# Altium project Chap7-1.PrjPCB
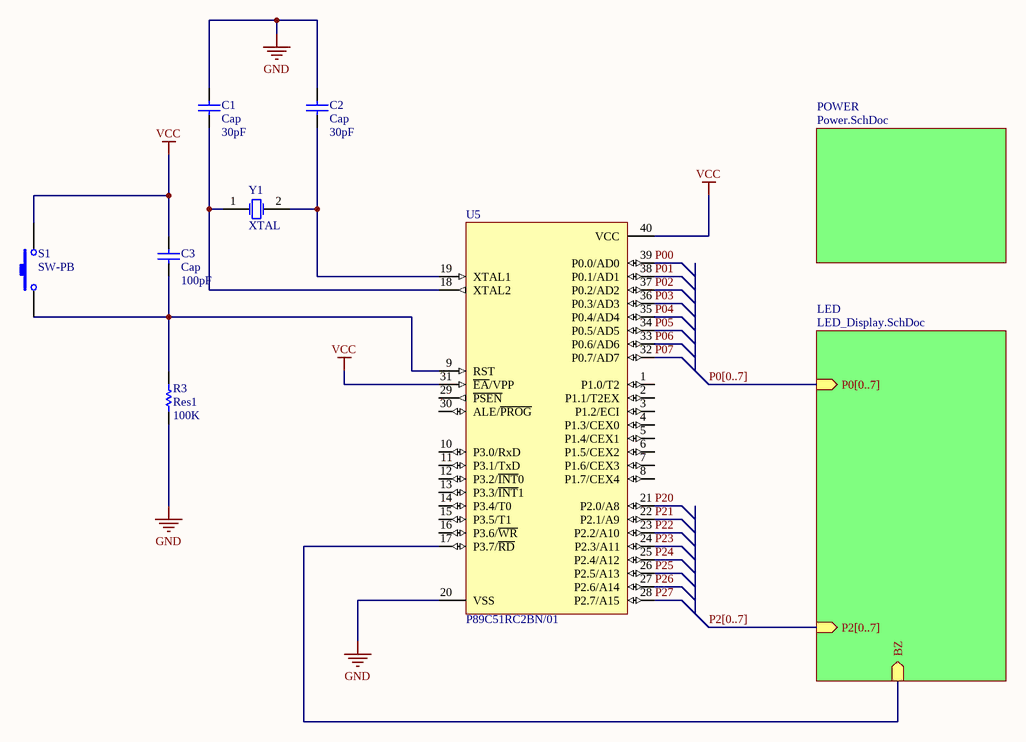
[diagram p0: MCU.SchDoc]
3 sheets, 31 parts. Net scope: hierarchical (ports join the sheet entries above them; power ports are global).
Sheets:
  MCU.SchDoc
    POWER = Power.SchDoc
    LED = LED_Display.SchDoc

## Sheet MCU.SchDoc
size A4

### Parts
C1  Cap  value 30pF  [RAD-0.3]
C2  Cap  value 30pF  [RAD-0.3]
C3  Cap  value 100pF  [RAD-0.3]
R3  Res1  value 100K  [AXIAL-0.3]
S1  SW-PB  [SPST-2]
U5  P89C51RC2BN/01  [SOT129-1]
Y1  XTAL  [R38]

### Sub-sheets
LED = LED_Display.SchDoc: P0[0..7] (in), P2[0..7] (in), BZ (in)
POWER = Power.SchDoc: no entries

### Nets
GND: C1.2 C2.2 R3.1 U5.20(VSS)
VCC: C3.2 S1.2 U5.31(~{EA}/VPP) U5.40(VCC)
P00: U5.39(P0.0/AD0)
P01: U5.38(P0.1/AD1)
P02: U5.37(P0.2/AD2)
P03: U5.36(P0.3/AD3)
P04: U5.35(P0.4/AD4)
P05: U5.34(P0.5/AD5)
P06: U5.33(P0.6/AD6)
P07: U5.32(P0.7/AD7)
P20: U5.21(P2.0/A8)
P21: U5.22(P2.1/A9)
P22: U5.23(P2.2/A10)
P23: U5.24(P2.3/A11)
P24: U5.25(P2.4/A12)
P25: U5.26(P2.5/A13)
P26: U5.27(P2.6/A14)
P27: U5.28(P2.7/A15)
NetC1_1: C1.1 U5.18(XTAL2) Y1.1(OSC1)
NetC2_1: C2.1 U5.19(XTAL1) Y1.2(OSC2)
NetC3_1: C3.1 R3.2 S1.1 U5.9(RST)
NetR1_1: U5.17(P3.7/~{RD}) ; sheet LED/BZ

Not connected (* = marked no-connect by the designer): U5 1(P1.0/T2) 2(P1.1/T2EX) 3(P1.2/ECI) 4(P1.3/CEX0) 5(P1.4/CEX1) 6(P1.5/CEX2) 7(P1.6/CEX3) 8(P1.7/CEX4) 10(P3.0/RxD) 11(P3.1/TxD) 12(P3.2/~{INT}0) 13(P3.3/~{INT}1) 14(P3.4/T0) 15(P3.5/T1) 16(P3.6/~{WR}) 29(~{PSEN}) 30(ALE/~{PROG})

### Buses and harness runs
bus P0[0..7] = sheet LED/P0[0..7]
bus P2[0..7] = sheet LED/P2[0..7]

### Library data of the parts
C1-C3 = Cap: Capacitor; Published: 8-Jun-2000; LatestRevisionDate: 17-Jul-2002; LatestRevisionNote: Re-released for DXP Platform.; PackageReference: RAD-0.3; Publisher: Altium Limited; PackageDescription: Radial Cap, Thru-Hole; 2 Leads; 0.3 in Pin Spacing
R3 = Res1: Resistor; Published: 8-Jun-2000; LatestRevisionDate: 17-Jul-2002; LatestRevisionNote: Re-released for DXP Platform.; PackageReference: AXIAL-0.3; Publisher: Altium Limited; PackageDescription: Axial Device, Thru-Hole; 2 Leads; 0.3 in Pin Spacing
S1 = SW-PB: Switch; Published: 24-Mar-1999; LatestRevisionDate: 17-Jul-2002; LatestRevisionNote: Re-released for DXP Platform.; PackageReference: SPST-2; Publisher: Altium Limited; PackageDescription: Switch; 2 Leads
U5 = P89C51RC2BN/01: 80C51 8-Bit Flash Microcontroller Family, 32 kB ISP/IAP Flash with 512 B RAM.; Published: 21-May-2003; DatasheetVersion: 18-Jul-2002; PackageVersion: Aug-2000; PackageReference: SOT129-1; Publisher: Altium Limited; PackageDescription: DIP, Plastic; 40 Leads; Row Spacing 15.24 mm; Pitch 2.54 mm; Code_JEDEC: MO-015; ComponentLink1Description: Manufacturer Link; ComponentLink1URL: http://www-us2.semiconductors.philips.com/; ComponentLink2Description: Datasheet; ComponentLink2URL: http://www.semiconductors.philips.com/acrobat/datasheets/P89C51RA2_RB2_RC2_RD2_2.pdf
Y1 = XTAL: Crystal Oscillator; Published: 8-Jun-2000; LatestRevisionDate: 17-Jul-2002; LatestRevisionNote: Re-released for DXP Platform.; PackageReference: R38; Publisher: Altium Limited; PackageDescription: Crystal, Thru-Hole; 2 Leads; Body 3.1 x 8.2 mm (Dia.xH)

## Sheet Power.SchDoc
size A4
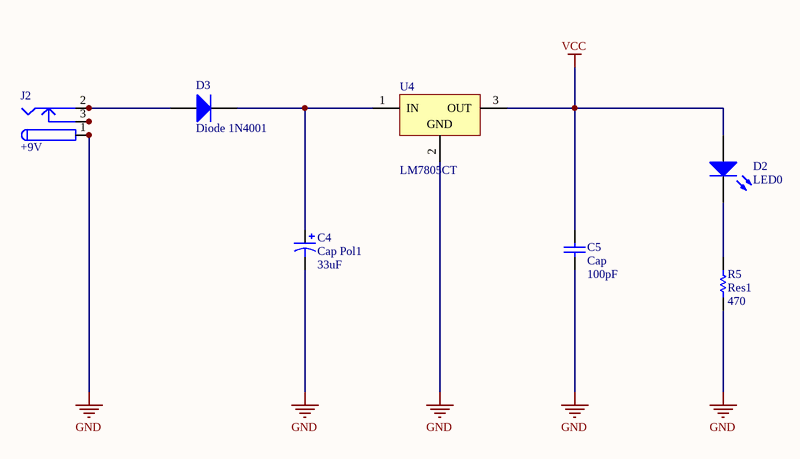
[diagram p1: Power.SchDoc]

### Parts
C4  Cap Pol1  value 33uF  [RB7.6-15]
C5  Cap  value 100pF  [RAD-0.3]
D2  LED0  [LED-0]
D3  Diode 1N4001  [DO-41]
J2  +9V  [KLD-0202]
R5  Res1  value 470  [AXIAL-0.3]
U4  LM7805CT  [T03B]

### Nets
GND: C4.2 C5.1 J2.1 J2.1A J2.1B R5.1 U4.2(GND)
VCC: C5.2 D2.1(A) U4.3(OUT)
NetC4_1: C4.1 D3.2(K) U4.1(IN)
NetD2_2: D2.2(K) R5.2
NetD3_1: D3.1(A) J2.2 J2.2A J2.2B
NetJ2_3: J2.3 J2.3A J2.3B

### Library data of the parts
C4 = Cap Pol1: Polarized Capacitor (Radial); Published: 8-Jun-2000; LatestRevisionDate: 17-Jul-2002; LatestRevisionNote: Re-released for DXP Platform.; PackageReference: RB7.6-15; Publisher: Altium Limited; PackageDescription: Polarized Capacitor (Radial); 2 Leads
C5 = Cap: Capacitor; Published: 8-Jun-2000; LatestRevisionDate: 17-Jul-2002; LatestRevisionNote: Re-released for DXP Platform.; PackageReference: RAD-0.3; Publisher: Altium Limited; PackageDescription: Radial Cap, Thru-Hole; 2 Leads; 0.3 in Pin Spacing
D2 = LED0: Typical INFRARED GaAs LED; Published: 8-Jun-2000; LatestRevisionDate: 08-Jul-2005; LatestRevisionNote: Mech Layer 1 removed.; PackageReference: LED-0; Publisher: Altium Limited; PackageDescription: LED; 2 Leads
D3 = Diode 1N4001: 1 Amp General Purpose Rectifier; Published: 8-Jun-2000; LatestRevisionDate: 17-Jul-2002; LatestRevisionNote: Re-released for DXP Platform.; DatasheetVersion: 1998; PackageVersion: Aug-1999; PackageReference: DO-41; Publisher: Altium Limited; PackageDescription: Diode, Axial; Body 5.2 x 2.7 mm (LxDia. max), Lead Dia. 0.86 mm (max); Code_JEDEC: DO-204-AL; ComponentLink1Description: Manufacturer Link; ComponentLink1URL: http://www.fairchildsemi.com/; ComponentLink2Description: Datasheet; ComponentLink2URL: http://www.fairchildsemi.com/ds/1N%2F1N4001.pdf
J2 = PWR2.5: Low Voltage Power Supply Connector; Published: 17-Dec-2003; DatasheetDocument: 09-May-2002; Publisher: Altium Limited; ComponentLink1Description: Manufacturer Link; ComponentLink1URL: http://domino.kycon.com/internet/Products.html
R5 = Res1: Resistor; Published: 8-Jun-2000; LatestRevisionDate: 17-Jul-2002; LatestRevisionNote: Re-released for DXP Platform.; PackageReference: AXIAL-0.3; Publisher: Altium Limited; PackageDescription: Axial Device, Thru-Hole; 2 Leads; 0.3 in Pin Spacing
U4 = LM7818CT: Series 3-Terminal Positive Regulator; Note: Tab is connected to GND; ComponentAvailability: Obsolete; Published: 15-Apr-2002; DatasheetVersion: May-1999; PackageVersion: 1995; PackageReference: T03B; Publisher: Altium Limited; PackageDescription: TO, Thru-Hole, Vertical, Heatsink Mounted; 3 In-Line Leads; Pitch 2.54 mm; ComponentLink1Description: Manufacturer Link; ComponentLink1URL: http://www.national.com/; ComponentLink2Description: Discontinuation Notice; ComponentLink2URL: http://www.national.com/obs/obsolescence.txt

## Sheet LED_Display.SchDoc
size A4
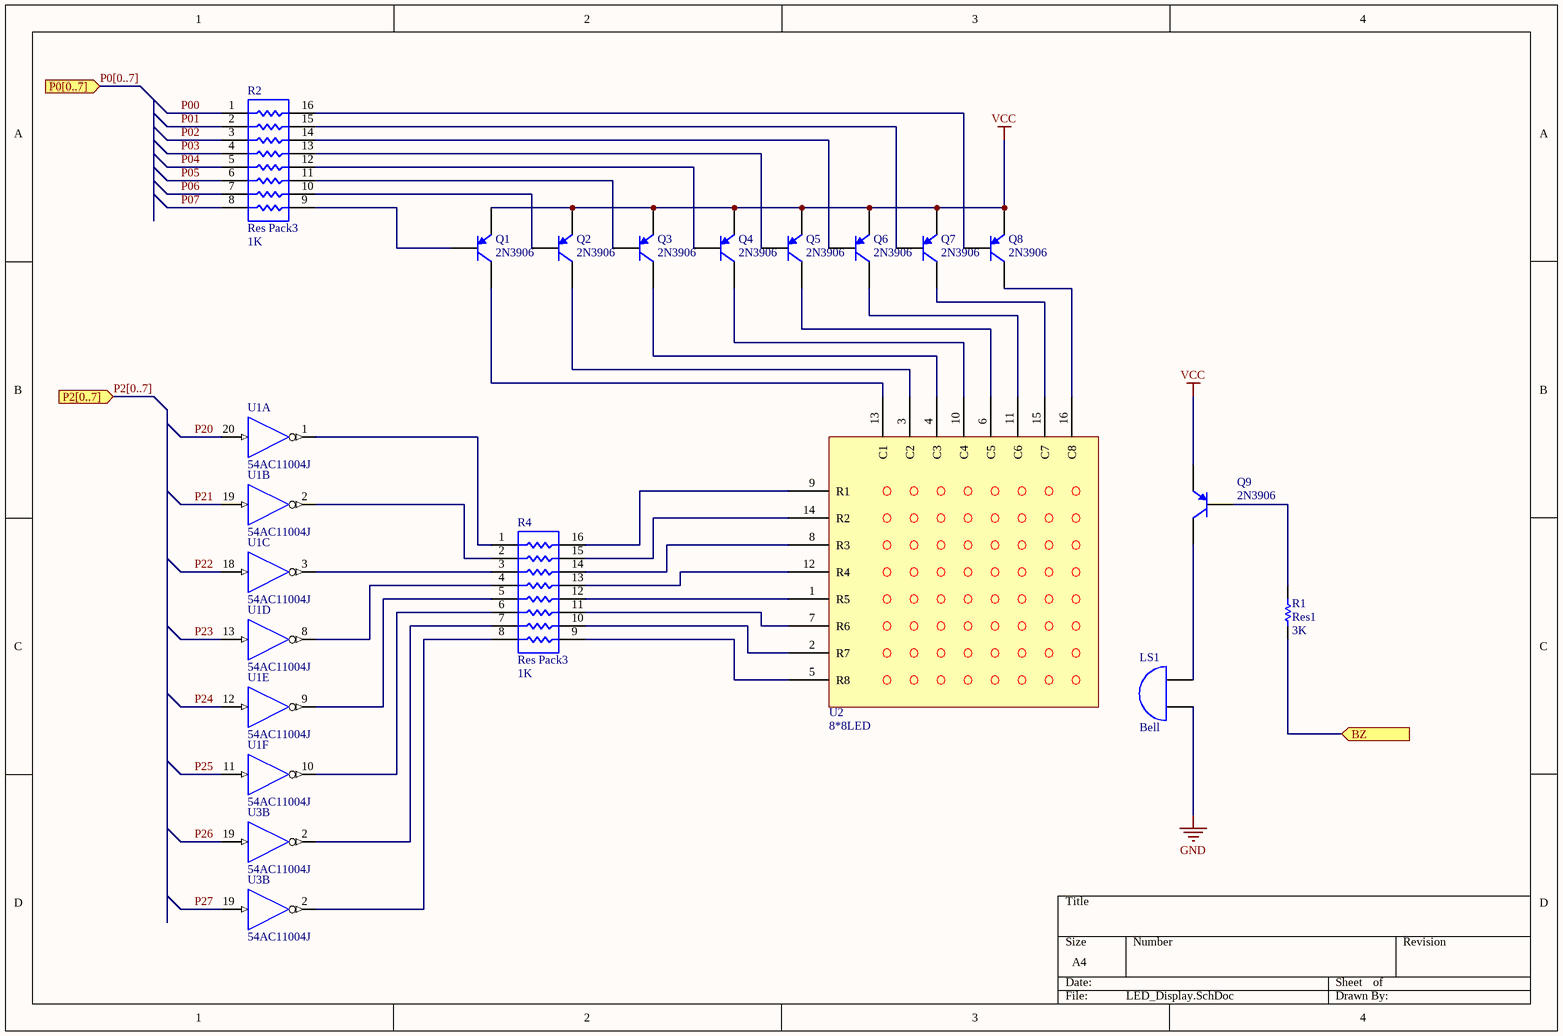
[diagram p2: LED_Display.SchDoc]

### Parts
(Parts that share a designator on the sheet are numbered #1, #2 ... from top to bottom, then left to right.)
LS1  Bell  [PIN2]
Q1  2N3906  [TO-92A]
Q2  2N3906  [TO-92A]
Q3  2N3906  [TO-92A]
Q4  2N3906  [TO-92A]
Q5  2N3906  [TO-92A]
Q6  2N3906  [TO-92A]
Q7  2N3906  [TO-92A]
Q8  2N3906  [TO-92A]
Q9  2N3906  [TO-92A]
R1  Res1  value 3K  [AXIAL-0.3]
R2  Res Pack3  value 1K  [SO-16_N]
R4  Res Pack3  value 1K  [SO-16_N]
U1  54AC11004J  [J020D]  (parts A,B,C,D,E,F of 6)
U2  8*8LED  [8*8LED]
U3#1  54AC11004J  [J020D]  (part B of 6)
U3#2  54AC11004J  [J020D]  (part B of 6)

### Ports
BZ (in), P0[0..7] (in), P2[0..7] (in)

### Nets
GND: LS1.1(A) U1.4(GND) U1.5(GND) U1.6(GND) U1.7(GND) U3#1.4(GND) U3#1.5(GND) U3#1.6(GND) U3#1.7(GND) U3#2.4(GND) U3#2.5(GND) U3#2.6(GND) U3#2.7(GND)
VCC: Q1.1(E) Q2.1(E) Q3.1(E) Q4.1(E) Q5.1(E) Q6.1(E) Q7.1(E) Q8.1(E) Q9.1(E) U1.15(VCC) U1.16(VCC) U3#1.15(VCC) U3#1.16(VCC) U3#2.15(VCC) U3#2.16(VCC)
P00: R2.1
P01: R2.2
P02: R2.3
P03: R2.4
P04: R2.5
P05: R2.6
P06: R2.7
P07: R2.8
P20: U1.20(A)
P21: U1.19(A)
P22: U1.18(A)
P23: U1.13(A)
P24: U1.12(A)
P25: U1.11(A)
P26: U3#1.19(A)
P27: U3#2.19(A)
NetLS1_2: LS1.2(B) Q9.3(C)
NetQ1_2: Q1.2(B) R2.9
NetQ1_3: Q1.3(C) U2.13(C1)
NetQ2_2: Q2.2(B) R2.10
NetQ2_3: Q2.3(C) U2.3(C2)
NetQ3_2: Q3.2(B) R2.11
NetQ3_3: Q3.3(C) U2.4(C3)
NetQ4_2: Q4.2(B) R2.12
NetQ4_3: Q4.3(C) U2.10(C4)
NetQ5_2: Q5.2(B) R2.13
NetQ5_3: Q5.3(C) U2.6(C5)
NetQ6_2: Q6.2(B) R2.14
NetQ6_3: Q6.3(C) U2.11(C6)
NetQ7_2: Q7.2(B) R2.15
NetQ7_3: Q7.3(C) U2.15(C7)
NetQ8_2: Q8.2(B) R2.16
NetQ8_3: Q8.3(C) U2.16(C8)
NetQ9_2: Q9.2(B) R1.2
NetR1_1: R1.1 ; port BZ
NetR4_1: R4.1 U1.1(Y)
NetR4_2: R4.2 U1.2(Y)
NetR4_3: R4.3 U1.3(Y)
NetR4_4: R4.4 U1.8(Y)
NetR4_5: R4.5 U1.9(Y)
NetR4_6: R4.6 U1.10(Y)
NetR4_7: R4.7 U3#1.2(Y)
NetR4_8: R4.8 U3#2.2(Y)
NetR4_9: R4.9 U2.5(R8)
NetR4_10: R4.10 U2.2(R7)
NetR4_11: R4.11 U2.7(R6)
NetR4_12: R4.12 U2.1(R5)
NetR4_13: R4.13 U2.12(R4)
NetR4_14: R4.14 U2.8(R3)
NetR4_15: R4.15 U2.14(R2)
NetR4_16: R4.16 U2.9(R1)

### Buses and harness runs
bus P0[0..7] = port P0[0..7]
bus P2[0..7] = port P2[0..7]

### Library data of the parts
LS1 = Bell: Electrical Bell; Published: 24-Mar-1999; LatestRevisionDate: 17-Jul-2002; LatestRevisionNote: Re-released for DXP Platform.; PackageReference: PIN2; Publisher: Altium Limited
Q1-Q9 = 2N3906: PNP General Purpose Amplifier; Published: 8-Jun-2000; LatestRevisionDate: 15-Jan-2003; LatestRevisionNote: PCB Footprint 'BCY-W3/D4.7' replaced; DatasheetVersion: 1997; PackageVersion: Sep-1998; PackageReference: TO-92A; Publisher: Altium Limited; PackageDescription: TO, Flat Index; 3 In-Line, Axial Leads; Body Dia. 4.5mm; Leads 0.51 x 0.48 mm (max); ComponentLink1Description: Manufacturer Link; ComponentLink1URL: http://www.fairchildsemi.com/; ComponentLink2Description: Datasheet; ComponentLink2URL: http://www.fairchildsemi.com/ds/2N%2F2N3906.pdf
R1 = Res1: Resistor; Published: 8-Jun-2000; LatestRevisionDate: 17-Jul-2002; LatestRevisionNote: Re-released for DXP Platform.; PackageReference: AXIAL-0.3; Publisher: Altium Limited; PackageDescription: Axial Device, Thru-Hole; 2 Leads; 0.3 in Pin Spacing
R2 R4 = Res Pack3: Isolated Resistor Network; Published: 24-Mar-1999; LatestRevisionDate: 29-May-2009; LatestRevisionNote: IPC-7351 Footprint Added.; PackageReference: SO-16; Publisher: Altium Limited; PackageDescription: 16-Pin Small Outline Integrated Circuit 1.27 mm Pitch; Code_JEDEC: MS-012-AC; Code_IPC: SOIC127P600-16
U1 U3#1 U3#2 = 54AC11004J: Hex Inverter; Note: Pins 14 and 17 are not connected and not drawn; Published: 8-Jun-2000; LatestRevisionDate: 04-Mar-2005; LatestRevisionNote: Stylized 3D Model Added.; DatasheetVersion: Mar-1990; PackageVersion: Jun-1999; PackageReference: J020D; Publisher: Altium Limited; PackageDescription: DIP; 20 Leads; Row Spacing 7.62 mm; Pitch 2.54 mm; ComponentLink1Description: Manufacturer Link; ComponentLink1URL: http://www.ti.com/; ComponentLink2Description: Packaging Specification; ComponentLink2URL: http://focus.ti.com/lit/ml/mcer002d/mcer002d.pdf

## Nets that join several sheets
GND: MCU (C1.2 C2.2 R3.1 U5.20), Power (7 pins), LED_Display (13 pins)
VCC: MCU (C3.2 S1.2 U5.31 U5.40), Power (C5.2 D2.1 U4.3), LED_Display (15 pins)
NetR1_1: MCU (U5.17), LED_Display (R1.1)
P00: MCU (U5.39), LED_Display (R2.1)
P01: MCU (U5.38), LED_Display (R2.2)
P02: MCU (U5.37), LED_Display (R2.3)
P03: MCU (U5.36), LED_Display (R2.4)
P04: MCU (U5.35), LED_Display (R2.5)
P05: MCU (U5.34), LED_Display (R2.6)
P06: MCU (U5.33), LED_Display (R2.7)
P07: MCU (U5.32), LED_Display (R2.8)
P20: MCU (U5.21), LED_Display (U1.20)
P21: MCU (U5.22), LED_Display (U1.19)
P22: MCU (U5.23), LED_Display (U1.18)
P23: MCU (U5.24), LED_Display (U1.13)
P24: MCU (U5.25), LED_Display (U1.12)
P25: MCU (U5.26), LED_Display (U1.11)
P26: MCU (U5.27), LED_Display (U3#1.19)
P27: MCU (U5.28), LED_Display (U3#2.19)